# Altium schematic sheet MAIN.SchDoc
size A4; SheetNumber: 2; SheetTotal: 11
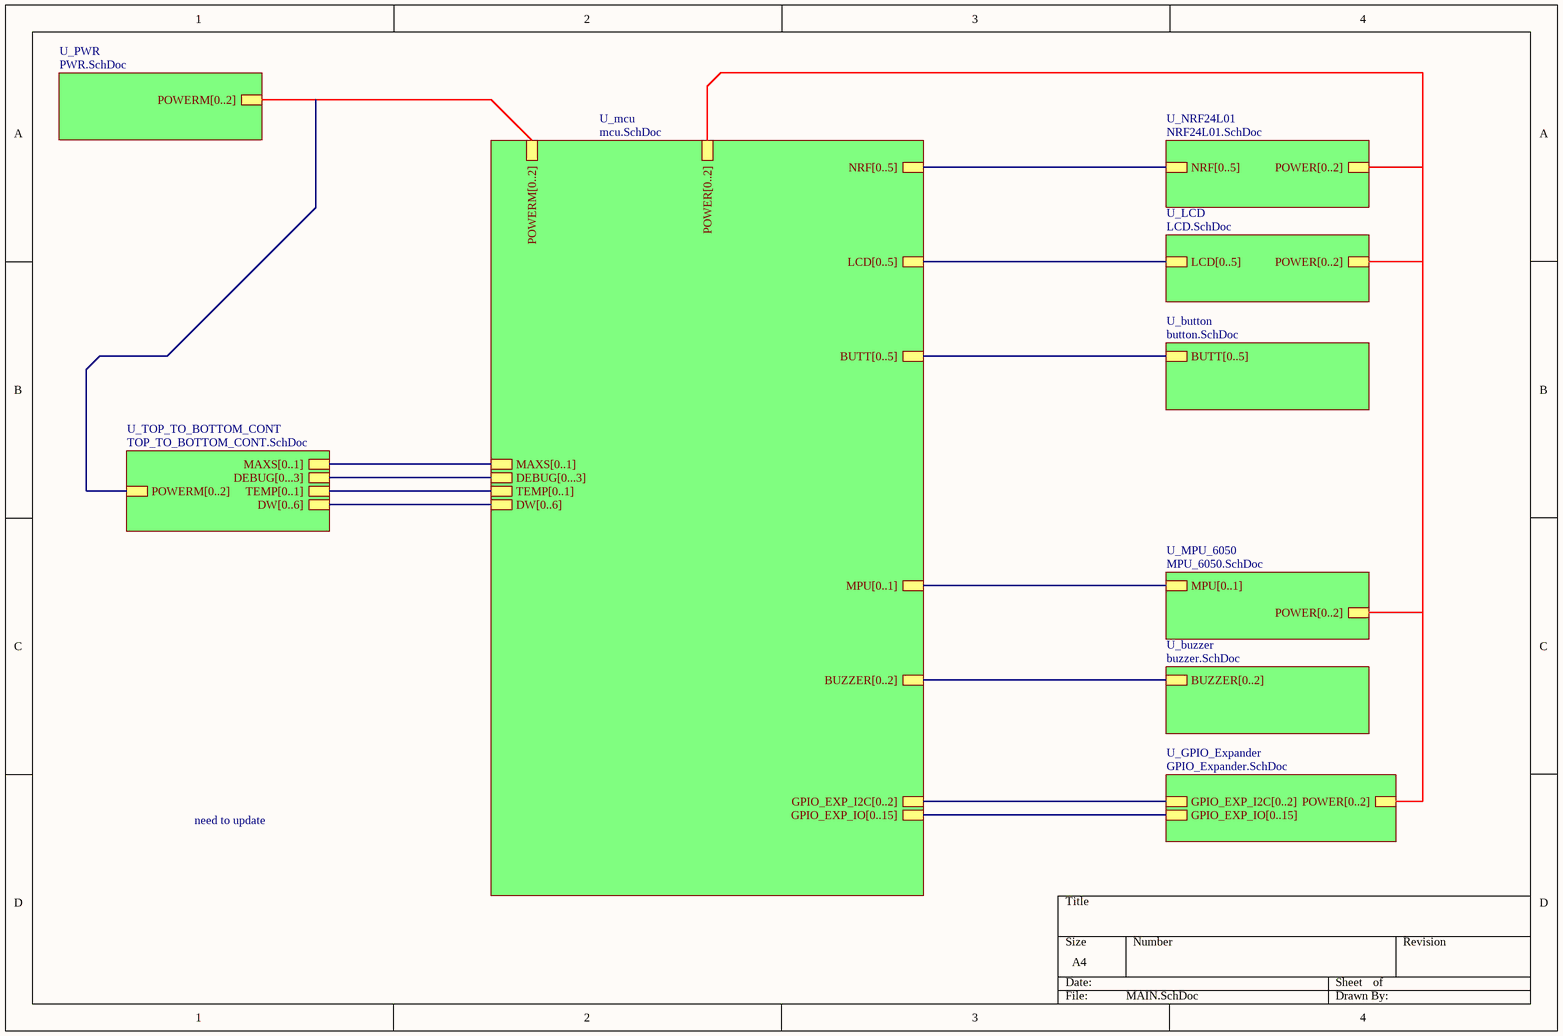
[diagram p0: MAIN.SchDoc]

## Sub-sheets
U_button = button.SchDoc: BUTT[0..5]
U_buzzer = buzzer.SchDoc: BUZZER[0..2]
U_GPIO_Expander = GPIO_Expander.SchDoc: POWER[0..2], GPIO_EXP_I2C[0..2], GPIO_EXP_IO[0..15]
U_LCD = LCD.SchDoc: POWER[0..2], LCD[0..5]
U_mcu = mcu.SchDoc: POWER[0..2], LCD[0..5], NRF[0..5], GPIO_EXP_I2C[0..2], MPU[0..1], BUZZER[0..2], GPIO_EXP_IO[0..15], BUTT[0..5], POWERM[0..2], MAXS[0..1], DEBUG[0...3], TEMP[0..1], DW[0..6]
U_MPU_6050 = MPU_6050.SchDoc: MPU[0..1], POWER[0..2]
U_NRF24L01 = NRF24L01.SchDoc: NRF[0..5], POWER[0..2]
U_PWR = PWR.SchDoc: POWERM[0..2]
U_TOP_TO_BOTTOM_CONT = TOP_TO_BOTTOM_CONT.SchDoc: MAXS[0..1], DW[0..6], TEMP[0..1], DEBUG[0...3], POWERM[0..2]

## Buses and harness runs
bus sheet U_button/BUTT[0..5] = sheet U_mcu/BUTT[0..5]
bus sheet U_buzzer/BUZZER[0..2] = sheet U_mcu/BUZZER[0..2]
bus sheet U_GPIO_Expander/GPIO_EXP_I2C[0..2] = sheet U_mcu/GPIO_EXP_I2C[0..2]
bus sheet U_GPIO_Expander/GPIO_EXP_IO[0..15] = sheet U_mcu/GPIO_EXP_IO[0..15]
bus sheet U_GPIO_Expander/POWER[0..2] = sheet U_LCD/POWER[0..2] = sheet U_mcu/POWER[0..2] = sheet U_MPU_6050/POWER[0..2] = sheet U_NRF24L01/POWER[0..2]
bus sheet U_LCD/LCD[0..5] = sheet U_mcu/LCD[0..5]
bus sheet U_mcu/DEBUG[0...3] = sheet U_TOP_TO_BOTTOM_CONT/DEBUG[0...3]
bus sheet U_mcu/DW[0..6] = sheet U_TOP_TO_BOTTOM_CONT/DW[0..6]
bus sheet U_mcu/MAXS[0..1] = sheet U_TOP_TO_BOTTOM_CONT/MAXS[0..1]
bus sheet U_mcu/MPU[0..1] = sheet U_MPU_6050/MPU[0..1]
bus sheet U_mcu/NRF[0..5] = sheet U_NRF24L01/NRF[0..5]
bus sheet U_mcu/POWERM[0..2] = sheet U_PWR/POWERM[0..2] = sheet U_TOP_TO_BOTTOM_CONT/POWERM[0..2]
bus sheet U_mcu/TEMP[0..1] = sheet U_TOP_TO_BOTTOM_CONT/TEMP[0..1]

## Notes on the sheet
- need to update